# EAGLE design MotionSensorBoard (EAGLE 7.2.0)
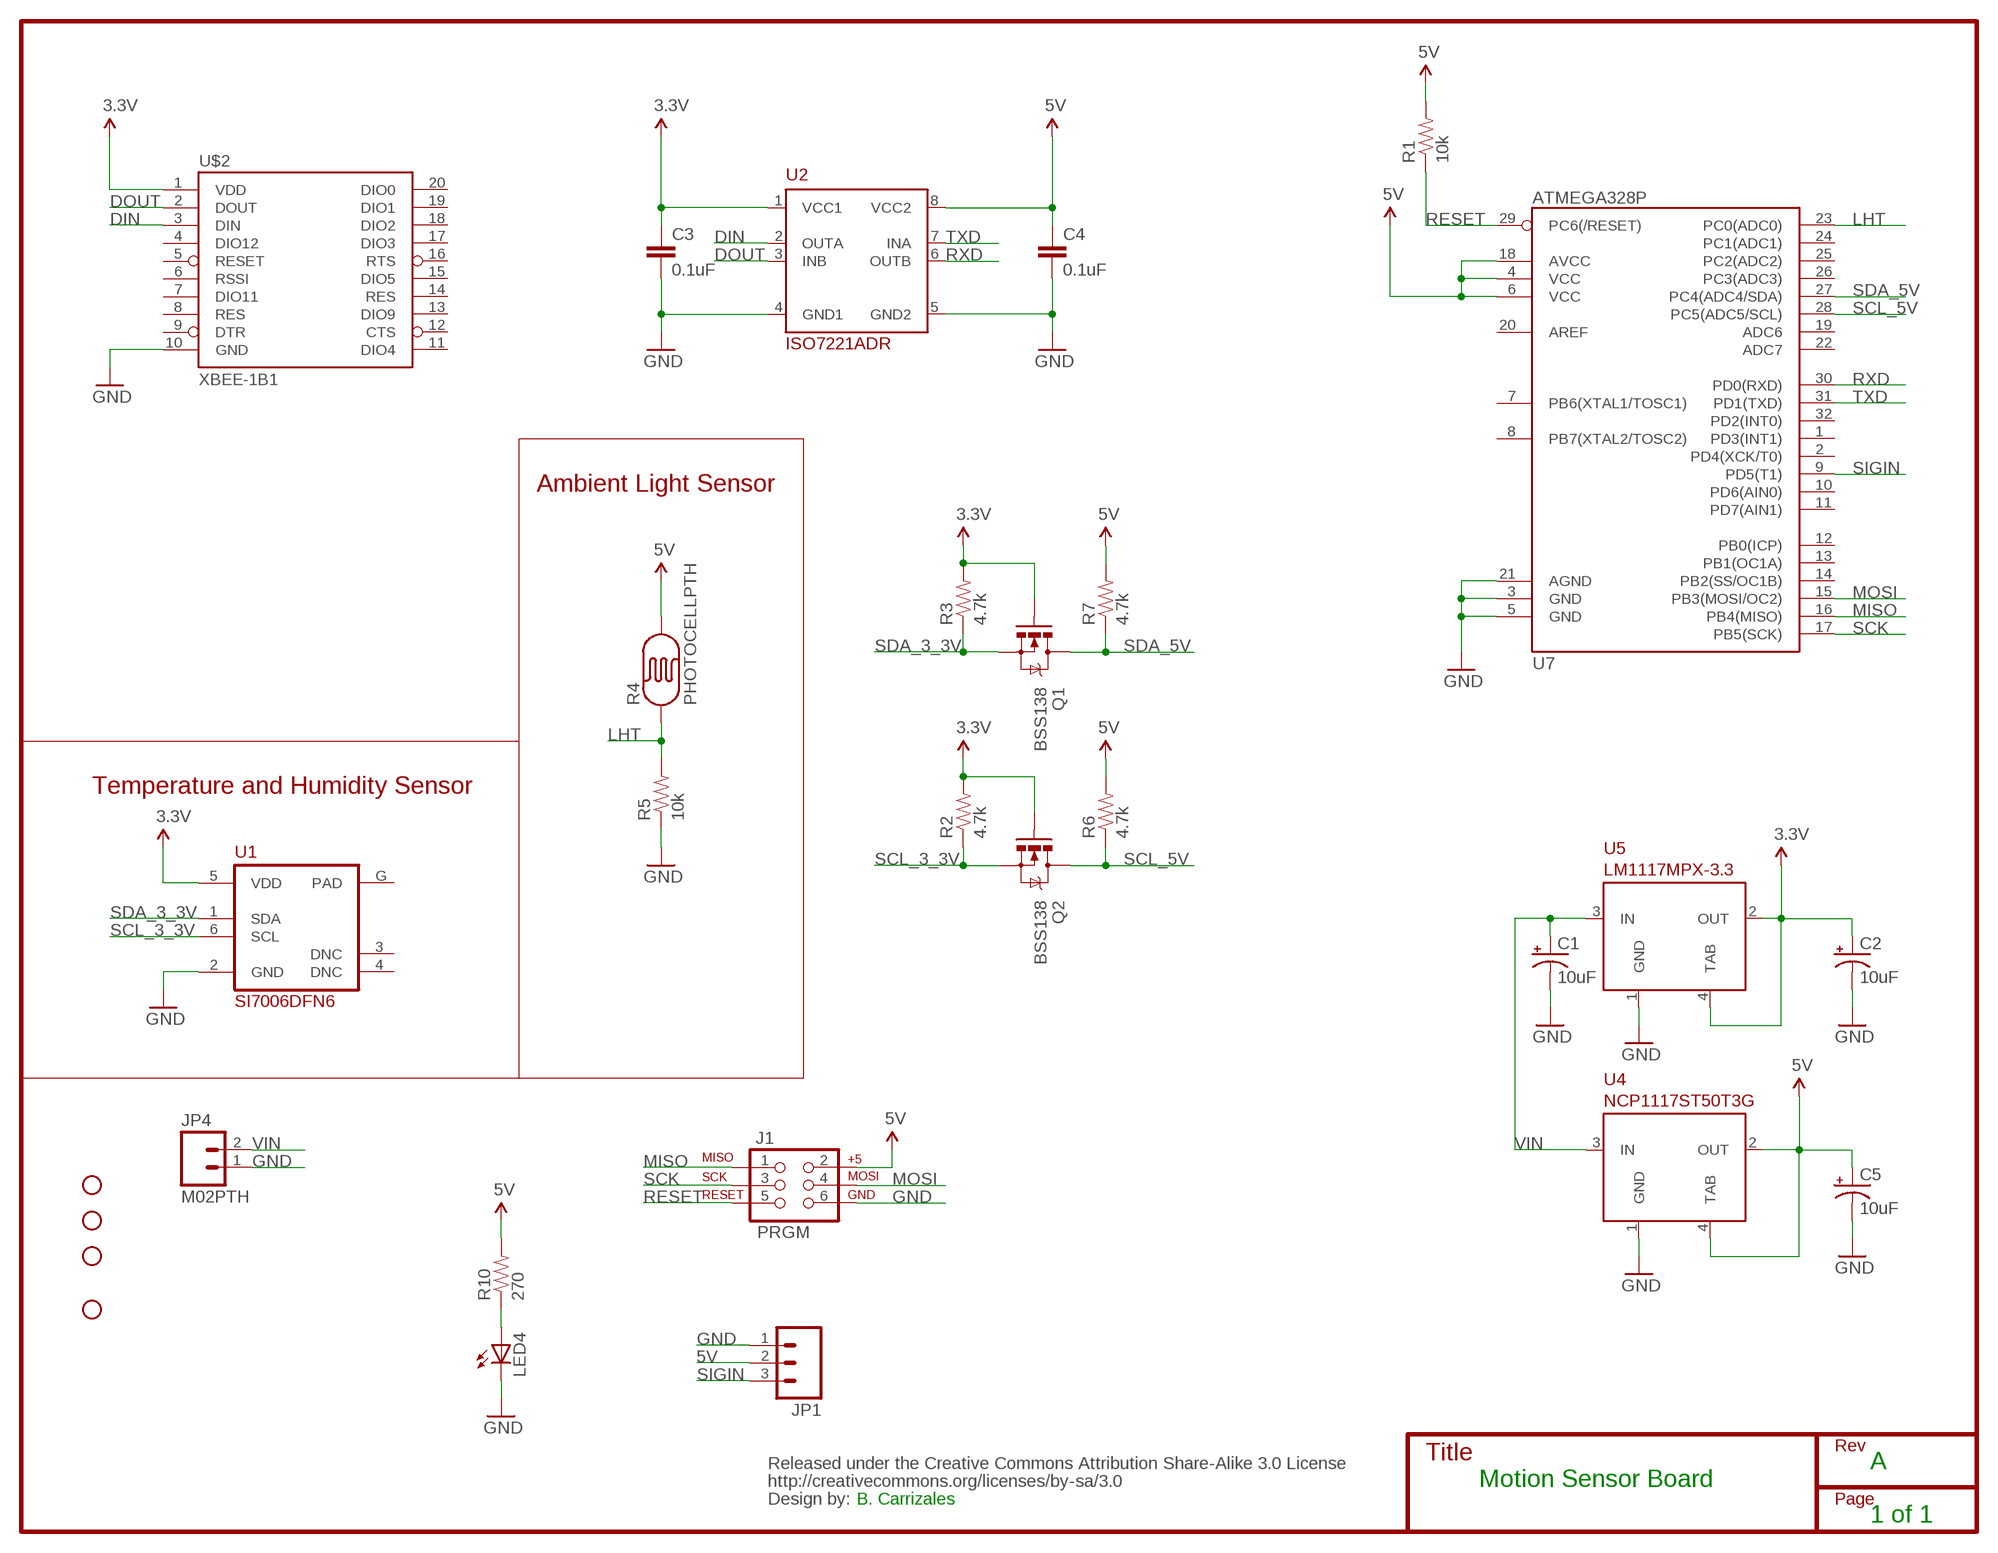
[diagram p0: schematic, sheet 1]

## Parts
C1  10uF  CAP_POL6032  [EIA6032]
C2  10uF  CAP_POL6032  [EIA6032]
C3  0.1uF  CAP0603-CAP  [0603-CAP]
C4  0.1uF  CAP0603-CAP  [0603-CAP]
C5  10uF  CAP_POL6032  [EIA6032]
CC_TEXT1  CREATIVE_COMMONS  [CREATIVE_COMMONS]
J1  PRGM  AVR_SPI_PRG_6PTH  [2X3]
JP1  M03PTH  [1X03]
JP4  M02PTH  [1X02]
LED4  LED0603  [LED-0603]
Q1  BSS138  MOSFET-NCHANNELBSS123LT1G  [SOT23]
Q2  BSS138  MOSFET-NCHANNELBSS123LT1G  [SOT23]
R1  10k  RESISTOR0603-RES  [0603-RES]
R2  4.7k  RESISTOR0603  [0603-RES]
R3  4.7k  RESISTOR0603  [0603-RES]
R4  PHOTOCELLPTH  [PHOTOCELL]
R5  10k  RESISTOR0603  [0603-RES]
R6  4.7k  RESISTOR0603  [0603-RES]
R7  4.7k  RESISTOR0603  [0603-RES]
R10  270  RESISTOR0603-RES  [0603-RES]
STANDOFF1  STAND-OFF  [STAND-OFF]
STANDOFF2  STAND-OFF  [STAND-OFF]
STANDOFF3  STAND-OFF  [STAND-OFF]
STANDOFF4  STAND-OFF  [STAND-OFF]
U1  SI7006DFN6  [DFN-6]
U2  ISO7221ADR  [SO08]
U4  NCP1117ST50T3G  [SOT223]
U5  LM1117MPX-3.3  [SOT223]
U7  ATMEGA328P  ATMEGA328_SMT  [TQFP32-08]
U$2  XBEE-1B1  [XBEE-1]

## Nets
3.3V: C2.P$1(+) C3.1 Q1.1(G) Q2.1(G) R2.2 R3.2 U1.5(VDD) U2.1(VCC1) U5.2(OUT) U5.4(TAB) U$2.1(VDD)
5V: C4.1 C5.P$1(+) J1.2 JP1.2 R1.2 R4.2 R6.2 R7.2 R10.2 U2.8(VCC2) U4.2(OUT) U4.4(TAB) U7.4(VCC) U7.6(VCC) U7.18(AVCC)
DIN: U2.2(OUTA) U$2.3(DIN)
DOUT: U2.3(INB) U$2.2(DOUT)
GND: C1.P$2(-) C2.P$2(-) C3.2 C4.2 C5.P$2(-) J1.6 JP1.1 JP4.1 LED4.C R5.1 U1.2(GND) U2.4(GND1) U2.5(GND2) U4.1(GND) U5.1(GND) U7.3(GND) U7.5(GND) U7.21(AGND) U$2.10(GND)
LHT: R4.1 R5.2 U7.23(PC0(ADC0))
MISO: J1.1 U7.16(PB4(MISO))
MOSI: J1.4 U7.15(PB3(MOSI/OC2))
N$19: LED4.A R10.1
RESET: J1.5 R1.1 U7.29(PC6(/RESET))
RXD: U2.6(OUTB) U7.30(PD0(RXD))
SCK: J1.3 U7.17(PB5(SCK))
SCL_3_3V: Q2.2(S) R2.1 U1.6(SCL)
SCL_5V: Q2.3(D) R6.1 U7.28(PC5(ADC5/SCL))
SDA_3_3V: Q1.2(S) R3.1 U1.1(SDA)
SDA_5V: Q1.3(D) R7.1 U7.27(PC4(ADC4/SDA))
SIGIN: JP1.3 U7.9(PD5(T1))
TXD: U2.7(INA) U7.31(PD1(TXD))
VIN: C1.P$1(+) JP4.2 U4.3(IN) U5.3(IN)
Unconnected: U1.3(DNC) U1.4(DNC) U1.G(PAD) U7.1(PD3(INT1)) U7.2(PD4(XCK/T0)) U7.7(PB6(XTAL1/TOSC1)) U7.8(PB7(XTAL2/TOSC2)) U7.10(PD6(AIN0)) U7.11(PD7(AIN1)) U7.12(PB0(ICP)) U7.13(PB1(OC1A)) U7.14(PB2(SS/OC1B)) U7.19(ADC6) U7.20(AREF) U7.22(ADC7) U7.24(PC1(ADC1)) U7.25(PC2(ADC2)) U7.26(PC3(ADC3)) U7.32(PD2(INT0)) U$2.4(DIO12) U$2.5(RESET) U$2.6(RSSI) U$2.7(DIO11) U$2.8(RES) U$2.9(DTR) U$2.11(DIO4) U$2.12(CTS) U$2.13(DIO9) U$2.14(RES) U$2.15(DIO5) U$2.16(RTS) U$2.17(DIO3) U$2.18(DIO2) U$2.19(DIO1) U$2.20(DIO0)

## Notes on the sheet
- Ambient Light Sensor
- Temperature and Humidity Sensor
- A
- Motion Sensor Board
- B. Carrizales
- 1 of 1

## Library data of the parts
C1 C2 C5 = SparkFun-Passives:CAP_POL: Capacitor Polarized These are standard SMD and PTH capacitors. Normally 10uF, 47uF, and 100uF in electrolytic and tantalum varieties. Always verify the external diameter of the through hole cap, it varies with capacity, voltage, and manufacturer. The EIA devices should be standard.
C3 C4 = SparkFun-Passives:CAP: Capacitor Standard 0603 ceramic capacitor, and 0.1" leaded capacitor.
CC_TEXT1 = SparkFun-Aesthetics:CREATIVE_COMMONS: Creative Commons License summary
J1 = SparkFun-Connectors:AVR_SPI_PRG_6: AVR ISP 6 Pin This is the reduced ISP connector for AVR programming. Common on Arduino. This footprint will take up less PCB space and can be used with a 10-pin to 6-pin adapter such as SKU: BOB-08508
JP1 = SparkFun-Connectors:M03: Header 3 Standard 3-pin 0.1" header. Use with straight break away headers (SKU : PRT-00116), right angle break away headers (PRT-00553), swiss pins (PRT-00743), machine pins (PRT-00117), and female headers (PRT-00115). Molex polarized connector foot print use with SKU : PRT-08232 with associated crimp pins and housings.
JP4 = SparkFun-Connectors:M02: Standard 2-pin 0.1" header. Use with - straight break away headers ( PRT-00116) - right angle break away headers (PRT-00553) - swiss pins (PRT-00743) - machine pins (PRT-00117) - female headers (PRT-00115) Molex polarized connector foot print use with: PRT-08233 with associated crimp pins and housings. 2.54_SCREWTERM for use with PRT-10571. 3.5mm Screw Terminal footprints for PRT-08084 5mm Screw Terminal footprints for use with PRT-08433
LED4 = SparkFun-LED:LED: LEDs Standard schematic elements and footprints for 5mm, 3mm, 1206, and 0603 sized LEDs. 5mm - Spark Fun Electronics SKU : COM-00529 (and others)
Q1 Q2 = SparkFun-DiscreteSemi:MOSFET-NCHANNEL: Common NMOSFET Parts MFG P/N Store ID Prod ID FDD8780 TRANS-09984 SI7820DN TRANS-11055 FDS6630A IC-08089 2N7002PW TRANS-11151 FQP30N06L COM-10213 TRANS-10060 BSS123LT1G TRANS-08345 BSS138 TRANS-00830 BS170 2N7000; PROD_ID: TRANS-08345
R1 R10 = SparkFun-Passives:RESISTOR: Resistor Basic schematic elements and footprints for 0603, 1206, and PTH resistors.
R2 R3 R5-R7 = SparkFun-Resistors:RESISTOR: Resistor Basic schematic elements and footprints for 0603, 1206, and PTH resistors.
R4 = SparkFun-Sensors:PHOTOCELL: CdS photoresistor. This is a low cost way to detect light levels. Resistance decreases with more incoming light. SparkFun SKU: SEN-09088
STANDOFF1-STANDOFF4 = SparkFun-Electromechanical:STAND-OFF: #4 Stand Off This is the mechanical footprint for a #4 phillips button head screw. Use the keepout ring to avoid running the screw head into surrounding components. SKU : PRT-00447
U1 = DigitalICs:SI7006: Si7006 Temperature and Humidity I2C Sensor
U2 = DigitalICs:ISO7221ADR: ISO7221 Dual Channel Digital Isolator from Texas Instruments. See Datasheet for more info Datasheet <http://www.ti.com/lit/ds/symlink/iso7220a.pdf>; DIGIKEYPART#: 296-21955-1-ND
U4 = regulators:NCP1117ST50T3G: NCP1117 5V, 1.0 A Low-Dropout Positive Fixed and Adjustable Voltage Regulator Datasheet <http://www.onsemi.com/pub_link/Collateral/NCP1117-D.PDF>; DIGIKEYPART#: NCP1117ST50T3GOSCT-ND
U5 = regulators:LM1117MPX-3.3: 3.3V Low Dropout Regulator, 0.8A output. See datasheet for more info Datasheet <http://www.ti.com/lit/ds/symlink/lm1117-n.pdf>; DIGIKEYPART#: LM1117MPX-3.3/NOPBCT-ND
U7 = SparkFun-DigitalIC:ATMEGA328_SMT: 32-Pin Atmega328 part Commonly used on Arduino compatible boards Available in QFP and QFN packages TQFP is IC-09069 QFN is non-stock; PROD_ID: IC-09069
U$2 = SparkFun-RF:XBEE-1: Xbee module footprints SMT header is CONN-09042.

## Board
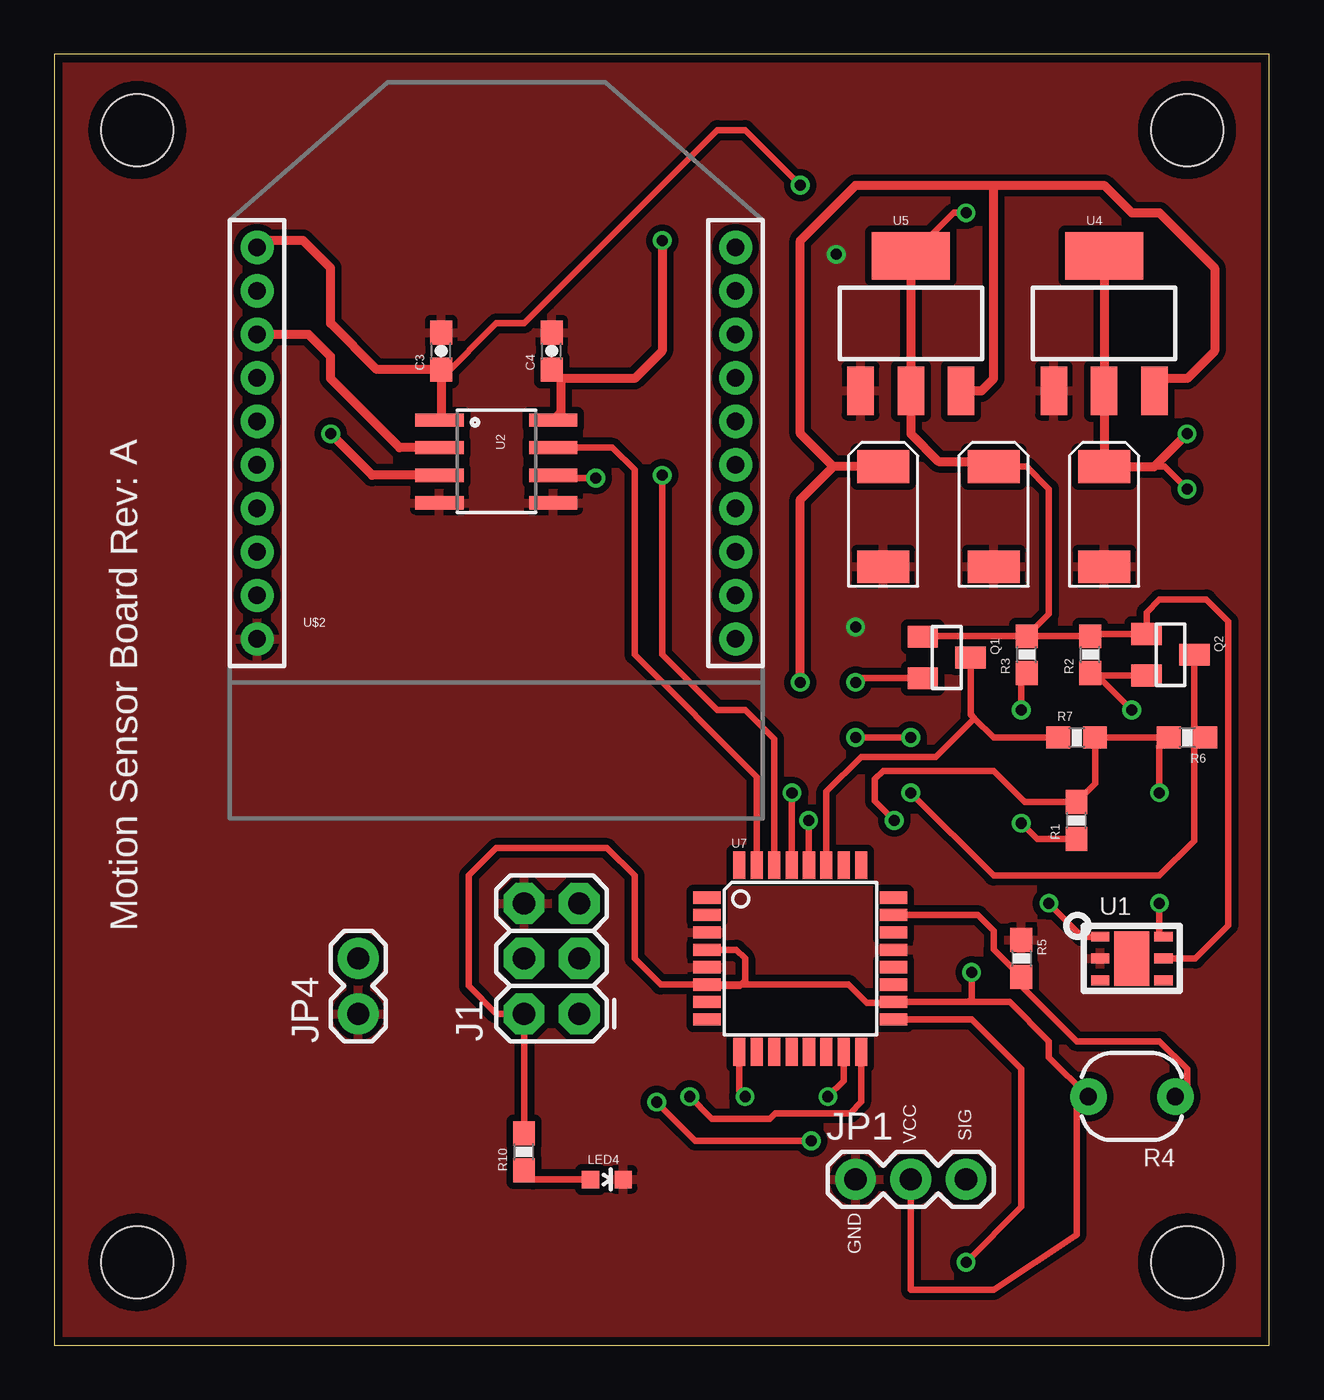
[diagram p1: board, top side]
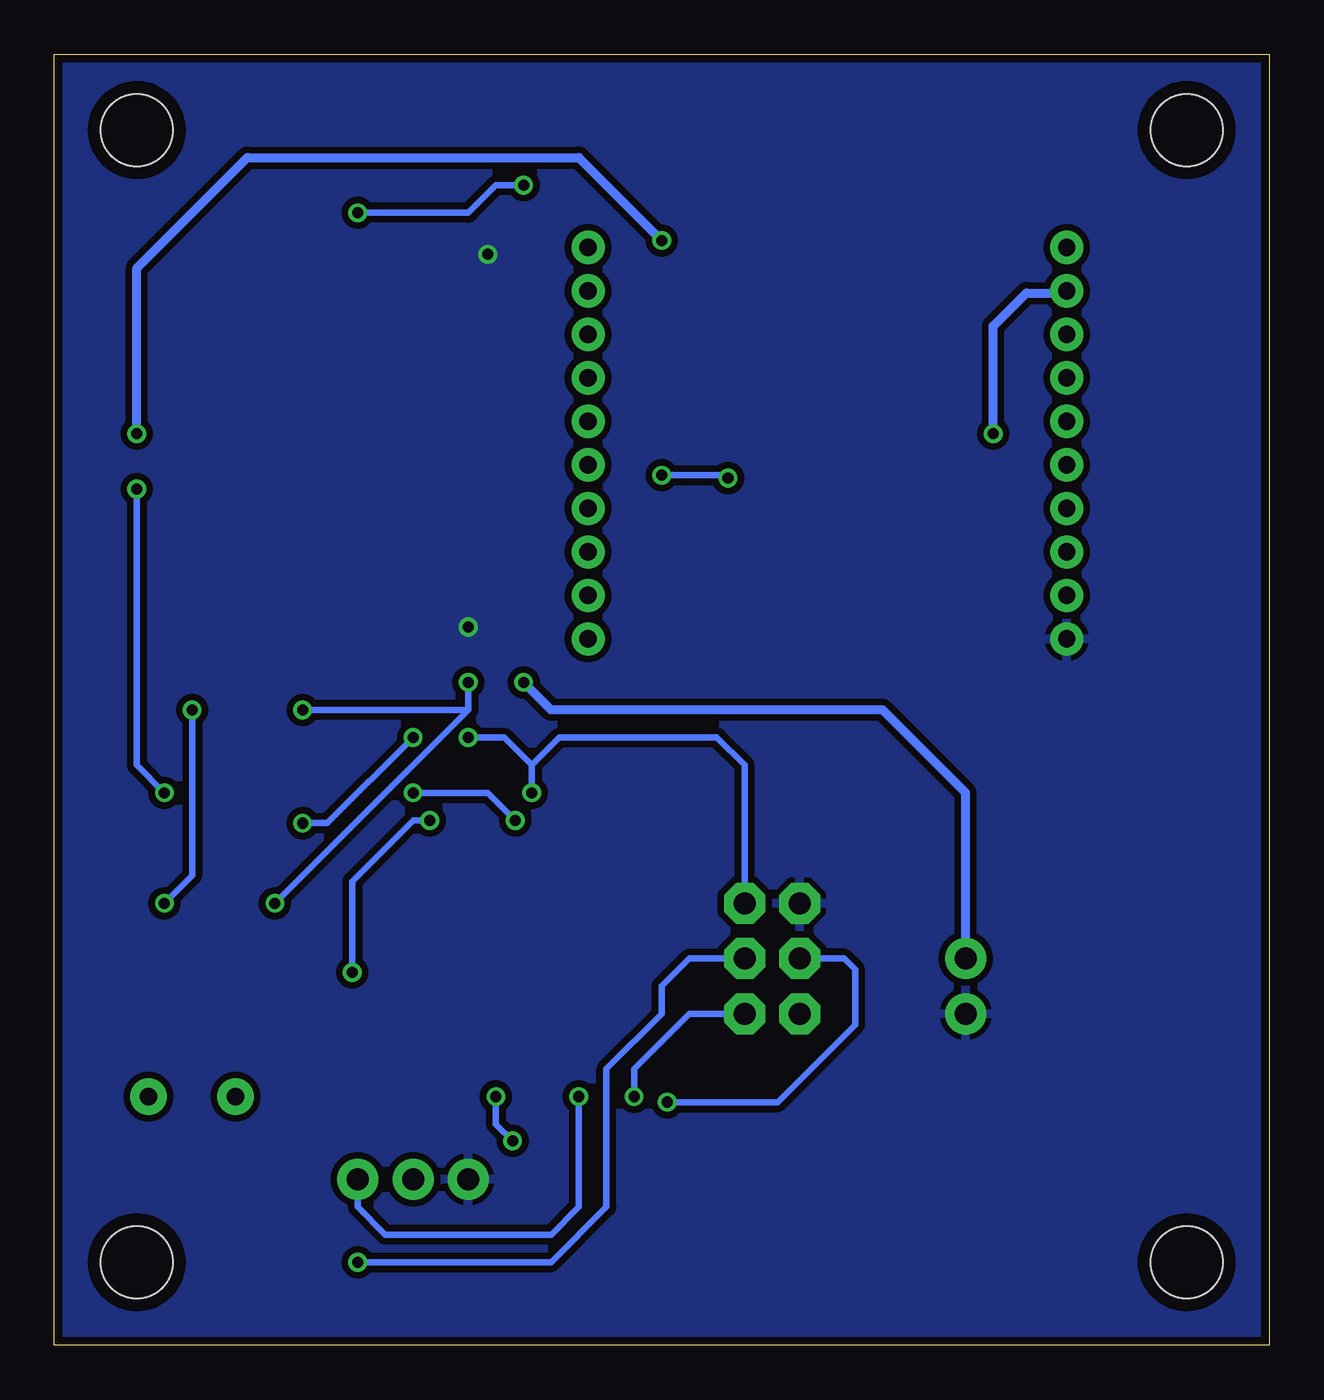
[diagram p2: board, bottom side, seen from below]

Size 55.86 x 59.36 mm. Coordinates in mm from the lower left corner, seen from the top.
Outline: 0,0 55.86,0 55.86,59.36 0,59.36 0,0
Copper layers (1*16): Top 0.0356mm / dielectric 1.5011mm / Bottom 0.0356mm
Design rules "LaenPCBOrder": minimum track width 6mil, minimum drill 13mil, track to track 6mil, track to pad 6mil, pad to pad 6mil, via to via 6mil, smd to smd 6mil, copper to edge 15mil, drill to drill 6mil, minimum pad ring 7mil, minimum via ring 7mil, stop-mask expansion 3mil, vias tented up to drill 0mil, thermal gap 10mil

### Footprints (pad centres in the part's own frame; a part is rotated, then mirrored left to right if it is on the bottom)
EIA6032 = smd 1.5 x 2.4: P$1 -2.3,0; P$2 2.3,0
0603-CAP = smd 1.1 x 1: 1 -0.85,0; 2 0.85,0
2X3 = drill 1.016 pad 1.88 octagon: 1 0,0; 2 0,2.54; 3 2.54,0; 4 2.54,2.54; 5 5.08,0; 6 5.08,2.54
1X03 = drill 1.016 pad 1.88: 1 0,0; 2 2.54,0; 3 5.08,0
1X02 = drill 1.016 pad 1.88: 1 0,0; 2 2.54,0
LED-0603 = smd 0.8 x 0.8: A 0,-0.75; C 0,0.75
SOT23 = smd 1 x 1.4: 1 -0.95,-1.1; 2 0.95,-1.1; 3 0,1.1
0603-RES = smd 1.1 x 1: 1 -0.85,0; 2 0.85,0
PHOTOCELL = drill 0.8 pad 1.676: 1 -2,0; 2 2,0
STAND-OFF = hole 3.302: 0,0
DFN-6 = smd 0.85 x 0.45: 1 -1.45,1; 2 -1.45,0; 3 -1.45,-1; 4 1.45,-1; 5 1.45,0; 6 1.45,1 | smd 1.6 x 2.5: G 0,0
SO08 = smd 0.61 x 2.21: 1 -1.905,-2.616; 2 -0.635,-2.616; 3 0.635,-2.616; 4 1.905,-2.616; 5 1.905,2.616; 6 0.635,2.616; 7 -0.635,2.616; 8 -1.905,2.616
SOT223 = smd 1.219 x 2.235: 1 -2.311,-3.099; 2 0,-3.099; 3 2.311,-3.099 | smd 3.6 x 2.2: 4 0,3.099
TQFP32-08 = smd 1.27 x 0.559: 1 -4.293,2.8; 2 -4.293,2; 3 -4.293,1.2; 4 -4.293,0.4; 5 -4.293,-0.4; 6 -4.293,-1.2; 7 -4.293,-2; 8 -4.293,-2.8; 17 4.293,-2.8; 18 4.293,-2; 19 4.293,-1.2; 20 4.293,-0.4; 21 4.293,0.4; 22 4.293,1.2; 23 4.293,2; 24 4.293,2.8 | smd 0.559 x 1.27: 9 -2.8,-4.293; 10 -2,-4.293; 11 -1.2,-4.293; 12 -0.4,-4.293; 13 0.4,-4.293; 14 1.2,-4.293; 15 2,-4.293; 16 2.8,-4.293; 25 2.8,4.293; 26 2,4.293; 27 1.2,4.293; 28 0.4,4.293; 29 -0.4,4.293; 30 -1.2,4.293; 31 -2,4.293; 32 -2.8,4.293
XBEE-1 = drill 0.8 pad 1.524: 1 -11,20; 2 -11,18; 3 -11,16; 4 -11,14; 5 -11,12; 6 -11,10; 7 -11,8; 8 -11,6; 9 -11,4; 10 -11,2; 11 11,2; 12 11,4; 13 11,6; 14 11,8; 15 11,10; 16 11,12; 17 11,14; 18 11,16; 19 11,18; 20 11,20

### Placement (x,y rotation side)
C1  38.1,38.1 270 top
C2  43.18,38.1 270 top
C3  17.78,45.72 90 top
C4  22.86,45.72 90 top
C5  48.26,38.1 270 top
CC_TEXT1  8.89,-10.16 0 top  (outside the outline)
J1  24.13,15.24 90 top
JP1  36.83,7.62 0 top
JP4  13.97,15.24 90 top
LED4  25.4,7.62 270 top
Q1  41.02,31.62 270 top
Q2  51.31,31.75 270 top
R1  46.99,24.13 90 top
R2  47.62,31.75 90 top
R3  44.7,31.75 90 top
R4  49.53,11.43 180 top
R5  44.45,17.78 270 top
R6  52.07,27.94 180 top
R7  46.99,27.94 0 top
R10  21.59,8.89 90 top
STANDOFF1  52.07,55.88 0 top
STANDOFF2  3.81,55.88 0 top
STANDOFF3  52.07,3.81 0 top
STANDOFF4  3.81,3.81 0 top
U1  49.53,17.78 0 top
U2  20.32,40.64 270 top
U4  48.26,46.99 0 top
U5  39.37,46.99 0 top
U7  34.29,17.78 0 top
U$2  20.32,30.48 0 top

### Tracks (layer width: path | path; a pad name or v marks a point on that pad's centre or on a via)
3.3V  (via drill 0.51)
  Top 0.305: R3.2 R2.2 47.73,32.7 Q2.1 50.21,33.7 50.8,34.29 52.96,34.29 53.98,33.27 53.98,19.3 52.45,17.78 U1.5 | R3.2 39.95,32.6 Q1.1 | C2.P$1 44.69,40.4 45.72,39.37 45.72,33.62 R3.2 | 17.78,42.62 17.78,44.45 20.32,46.99 21.59,46.99 30.48,55.88 31.75,55.88 v34.29,53.34 | v41.91,52.07 41.35,52.07 U5.4
  Top 0.406: U5.4 U5.2 39.37,41.91 40.64,40.64 42.94,40.64 C2.P$1 | U$2.1 9.64,50.8 11.43,50.8 12.7,49.53 12.7,46.99 14.82,44.87 C3.1 17.78,42.62 U2.1
  Bottom 0.305: v34.29,53.34 35.56,53.34 36.83,52.07 v41.91,52.07
5V  (via drill 0.51)
  Top 0.305: C5.P$1 51.04,40.4 v52.07,39.37 | v50.8,25.4 50.8,27.52 R6.2 R7.2 47.84,25.83 R1.2 44.62,24.98 43.18,26.42 38.1,26.42 37.72,26.04 37.72,25.02 v38.61,24.13 | U7.4 31.35,18.18 31.75,17.78 31.75,16.76 31.5,16.51 30.07,16.51 U7.6 | U7.6 36.51,16.58 37.34,15.75 38.55,15.75 U7.18 42.04,15.78 | 42.04,15.78 43.91,15.78 45.72,13.97 45.72,13.24 R4.2 46.99,10.89 46.99,5.08 43.18,2.54 39.37,2.54 JP1.2 | v42.16,17.14 42.16,15.91 42.04,15.78 | U7.6 27.87,16.58 26.67,17.78 26.67,21.59 25.4,22.86 20.32,22.86 19.05,21.59 19.05,16.51 20.32,15.24 J1.2 R10.2
  Top 0.406: U4.4 U4.2 C5.P$1 50.56,40.4 v52.07,41.91 | v27.94,50.8 27.94,45.72 26.67,44.45 23.28,44.45 | 23.28,44.45 C4.1 | 23.28,44.45 23.28,42.89 U2.8
  Bottom 0.305: v52.07,39.37 52.07,26.67 v50.8,25.4 | v38.61,24.13 39.37,24.13 42.16,21.34 v42.16,17.14
  Bottom 0.406: v52.07,41.91 52.07,49.53 46.99,54.61 31.75,54.61 v27.94,50.8
DIN
  Top 0.406: U2.2 15.88,41.27 12.7,44.45 12.7,45.47 11.68,46.48 U$2.3
DOUT  (via drill 0.51)
  Top 0.406: U2.3 14.61,40.01 v12.7,41.91
  Bottom 0.406: v12.7,41.91 12.7,46.86 11.18,48.39 9.41,48.39 U$2.2
GND  (via drill 0.51)
  other vias: 36.83,33.02 35.94,50.16
  pour Top (isolate 0.305): 0,59.69 0,0 55.88,0 55.88,59.69
  pour Bottom (isolate 0.305): 0,59.69 0,0 55.88,0 55.88,59.69
LHT
  Top 0.305: R4.1 52.07,11.97 52.07,12.7 50.8,13.97 46.99,13.97 44.45,16.51 R5.2 43.18,18.2 43.18,19.05 42.45,19.78 U7.23
MISO  (via drill 0.51)
  Top 0.305: U7.16 37.09,11.18 36.58,10.67 33.15,10.67 32.89,10.41 30.23,10.41 v29.21,11.43
  Bottom 0.305: v29.21,11.43 29.21,12.7 26.67,15.24 J1.1
MOSI  (via drill 0.51)
  Top 0.305: U7.15 36.29,12.16 v35.56,11.43 | v34.8,9.4 29.46,9.4 v27.69,11.18
  Bottom 0.305: v35.56,11.43 35.56,10.16 v34.8,9.4 | v27.69,11.18 22.61,11.18 19.05,14.73 19.05,17.27 19.56,17.78 J1.4
N$19
  Top 0.305: LED4.A 22.01,7.62 R10.1
RESET  (via drill 0.51)
  Top 0.305: R1.1 45.17,23.28 v44.45,24 | v39.37,27.94 v36.83,27.94 | v33.91,25.4 33.91,22.09 U7.29
  Bottom 0.305: v44.45,24 43.31,24 v39.37,27.94 | v36.83,27.94 35.18,27.94 33.91,26.67 | 33.91,26.67 v33.91,25.4 | J1.5 24.13,26.67 25.4,27.94 32.64,27.94 33.91,26.67
RXD  (via drill 0.51)
  Top 0.305: U7.30 33.09,27.87 31.75,29.21 30.48,29.21 27.94,31.75 v27.94,40.01 | v24.89,39.88 23.06,39.88 U2.6
  Bottom 0.305: v27.94,40.01 25.02,40.01 v24.89,39.88
SCK  (via drill 0.51)
  Top 0.305: U7.17 42.17,14.98 44.45,12.7 44.45,6.35 v41.91,3.81
  Bottom 0.305: v41.91,3.81 33.02,3.81 30.48,6.35 30.48,12.7 27.94,15.24 27.94,16.51 26.67,17.78 J1.3
SCL_3_3V  (via drill 0.51)
  Top 0.305: Q2.2 47.94,30.8 | R2.1 47.73,30.8 47.94,30.8 | 47.94,30.8 v49.53,29.21 | v50.8,20.32 50.8,18.96 U1.6
  Bottom 0.305: v49.53,29.21 49.53,21.59 v50.8,20.32
SCL_5V  (via drill 0.51)
  Top 0.305: Q2.3 52.41,28.45 | 52.41,28.45 R6.1 | 52.41,28.45 52.41,23.2 50.8,21.59 43.18,21.59 v39.37,25.4 | v34.67,24.13 34.67,22.09 U7.28
  Bottom 0.305: v39.37,25.4 35.94,25.4 v34.67,24.13
SDA_3_3V  (via drill 0.51)
  Top 0.305: Q1.2 37.02,30.67 v36.83,30.48 | v44.45,29.21 44.45,30.65 R3.1 | U1.1 47.26,18.78 v45.72,20.32
  Bottom 0.305: v36.83,30.48 36.83,29.21 | 36.83,29.21 v44.45,29.21 | v45.72,20.32 36.83,29.21
SDA_5V
  Top 0.305: Q1.3 42.12,29 42.29,28.83 | 42.29,28.83 43.18,27.94 R7.1 | U7.27 35.49,25.46 37.08,27.05 40.51,27.05 42.29,28.83
SIGIN  (via drill 0.51)
  Top 0.305: U7.9 31.49,11.69 v31.75,11.43
  Bottom 0.305: v31.75,11.43 31.75,6.35 33.02,5.08 40.64,5.08 41.91,6.35 JP1.3
TXD
  Top 0.305: U7.31 32.29,26.13 26.67,31.75 26.67,40.26 25.65,41.27 U2.7
VIN  (via drill 0.51)
  Top 0.406: C1.P$1 35.8,40.4 | 35.8,40.4 34.29,41.91 34.29,50.8 36.83,53.34 43.18,53.34 | 43.18,53.34 48.26,53.34 49.53,52.07 50.8,52.07 53.34,49.53 53.34,45.72 52.07,44.45 51.13,44.45 U4.3 | U5.3 42.62,43.89 43.18,44.45 43.18,53.34 | v34.29,30.48 34.29,38.89 35.8,40.4
  Bottom 0.406: JP4.2 13.97,25.4 17.78,29.21 33.02,29.21 v34.29,30.48

### Text on the board
tPlace: Motion Sensor Board Rev: A | VCC | SIG | GND
tDocu: B. Carrizales